# Altium schematic sheet Sheet1.SchDoc
size A4
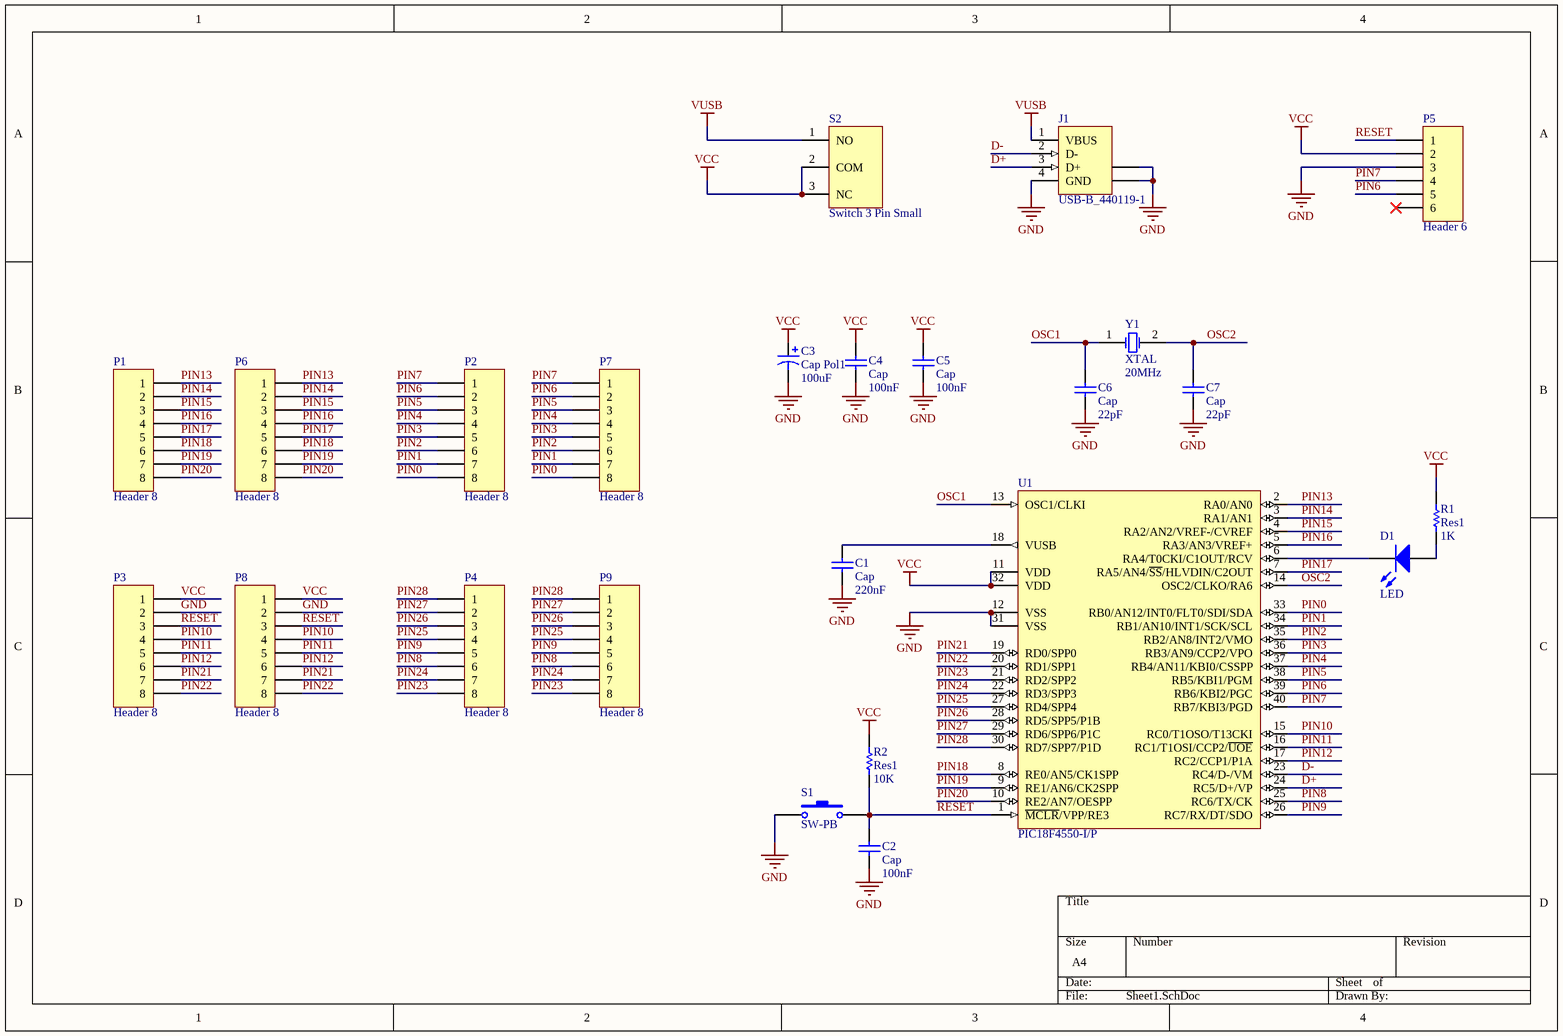
[diagram p0: Sheet1.SchDoc]

## Parts
C1  Cap  value 220nF  [C1206]
C2  Cap  value 100nF  [C1206]
C3  Cap Pol1  value 100uF  [CAP1]
C4  Cap  value 100nF  [C1206]
C5  Cap  value 100nF  [C1206]
C6  Cap  value 22pF  [C1206]
C7  Cap  value 22pF  [C1206]
D1  LED  [LED0]
J1  USB-B_440119-1  [USB-B]
P1  Header 8  [HDR1X8]
P2  Header 8  [HDR1X8]
P3  Header 8  [HDR1X8]
P4  Header 8  [HDR1X8]
P5  Header 6  [HDR1X6]
P6  Header 8  [HDR1X8]
P7  Header 8  [HDR1X8]
P8  Header 8  [HDR1X8]
P9  Header 8  [HDR1X8]
R1  Res1  value 1K  [C1206]
R2  Res1  value 10K  [C1206]
S1  SW-PB  [PUSH0]
S2  Switch 3 Pin Small  [SW_ON_OFF_SMALL]
U1  PIC18F4550-I/P  [PDIP600-P40]
Y1  XTAL  value 20MHz  [XTAL]

## Nets
GND: C1.1 C2.1 C3.2 C4.1 C5.1 C6.1 C7.1 J1.4(GND) J1.5(SHLD) J1.6(SHLD) P3.2 P5.3 P8.2 S1.1 U1.12(VSS) U1.31(VSS)
VCC: C3.1 C4.2 C5.2 P3.1 P5.2 P8.1 R1.2 R2.2 S2.2(COM) S2.3(NC) U1.11(VDD) U1.32(VDD)
VUSB: J1.1(VBUS) S2.1(NO)
D+: J1.3(D+) U1.24(RC5/D+/VP)
D-: J1.2(D-) U1.23(RC4/D-/VM)
OSC1: C6.2 U1.13(OSC1/CLKI) Y1.1(OSC1)
OSC2: C7.2 U1.14(OSC2/CLKO/RA6) Y1.2(OSC2)
PIN0: P2.8 P7.8 U1.33(RB0/AN12/INT0/FLT0/SDI/SDA)
PIN1: P2.7 P7.7 U1.34(RB1/AN10/INT1/SCK/SCL)
PIN2: P2.6 P7.6 U1.35(RB2/AN8/INT2/VMO)
PIN3: P2.5 P7.5 U1.36(RB3/AN9/CCP2/VPO)
PIN4: P2.4 P7.4 U1.37(RB4/AN11/KBI0/CSSPP)
PIN5: P2.3 P7.3 U1.38(RB5/KBI1/PGM)
PIN6: P2.2 P5.5 P7.2 U1.39(RB6/KBI2/PGC)
PIN7: P2.1 P5.4 P7.1 U1.40(RB7/KBI3/PGD)
PIN8: P4.6 P9.6 U1.25(RC6/TX/CK)
PIN9: P4.5 P9.5 U1.26(RC7/RX/DT/SDO)
PIN10: P3.4 P8.4 U1.15(RC0/T1OSO/T13CKI)
PIN11: P3.5 P8.5 U1.16(RC1/T1OSI/CCP2/~{UOE})
PIN12: P3.6 P8.6 U1.17(RC2/CCP1/P1A)
PIN13: P1.1 P6.1 U1.2(RA0/AN0)
PIN14: P1.2 P6.2 U1.3(RA1/AN1)
PIN15: P1.3 P6.3 U1.4(RA2/AN2/VREF-/CVREF)
PIN16: P1.4 P6.4 U1.5(RA3/AN3/VREF+)
PIN17: P1.5 P6.5 U1.7(RA5/AN4/~{SS}/HLVDIN/C2OUT)
PIN18: P1.6 P6.6 U1.8(RE0/AN5/CK1SPP)
PIN19: P1.7 P6.7 U1.9(RE1/AN6/CK2SPP)
PIN20: P1.8 P6.8 U1.10(RE2/AN7/OESPP)
PIN21: P3.7 P8.7 U1.19(RD0/SPP0)
PIN22: P3.8 P8.8 U1.20(RD1/SPP1)
PIN23: P4.8 P9.8 U1.21(RD2/SPP2)
PIN24: P4.7 P9.7 U1.22(RD3/SPP3)
PIN25: P4.4 P9.4 U1.27(RD4/SPP4)
PIN26: P4.3 P9.3 U1.28(RD5/SPP5/P1B)
PIN27: P4.2 P9.2 U1.29(RD6/SPP6/P1C)
PIN28: P4.1 P9.1 U1.30(RD7/SPP7/P1D)
RESET: C2.2 P3.3 P5.1 P8.3 R2.1 S1.2 U1.1(~{MCLR}/VPP/RE3)
NetC1_2: C1.2 U1.18(VUSB)
NetD1_1: D1.1(A) R1.1
NetD1_2: D1.2(K) U1.6(RA4/T0CKI/C1OUT/RCV)

Not connected (* = marked no-connect by the designer): P5 6*

## Library data of the parts
C1 C2 C4-C7 = Cap: Capacitor; Published: 8-Jun-2000; LatestRevisionDate: 17-Jul-2002; LatestRevisionNote: Re-released for DXP Platform.; PackageReference: RAD-0.3; Publisher: Altium Limited; PackageDescription: Radial Cap, Thru-Hole; 2 Leads; 0.3 in Pin Spacing
C3 = Cap Pol1: Polarized Capacitor (Radial); Published: 8-Jun-2000; LatestRevisionDate: 17-Jul-2002; LatestRevisionNote: Re-released for DXP Platform.; PackageReference: RB7.6-15; Publisher: Altium Limited; PackageDescription: Polarized Capacitor (Radial); 2 Leads
D1 = LED: Typical RED GaAs LED; Designer: Meysam Parvizi; Email: meysam.parvizi.ir@gmail.com; Weblog: http://mp.tabin.ir
J1 = USB-B_440119-1: USB 1.1, Right Angle, Thru-Hole, B Type, Receptacle, 4 Position, Beige; ContactMaterial: Copper Alloy; ContactPlating: Gold Flash over Nickel; TerminationLength: 2.84mm [0.112in.]; PCB_Layout: Complies with manufacturer's recommendation.; DrillSize: Corresponds to nominal value.; PanelGround: Without; Published: 15-Jul-2004; DatasheetDocument: 12-Jan-2004; PackageDocument: 12-Jan-2004; PackageReference: 440119; Publisher: Altium Limited; HousingMaterial: Thermoplastic; ComponentLink1Description: Manufacturer Link; ComponentLink1URL: http://www.tycoelectronics.com/; ComponentLink2Description: Packaging Specification; ComponentLink2URL: http://ecommas.tycoelectronics.com/commerce/DocumentDelivery/DDEController?Action=showdoc&DocId=Customer+Drawing%7F440119%7FC%7Ftif%7FEnglish%7FC_440119_C.tif
P1-P4 P6-P9 = Header 8: Header, 8-Pin; LatestRevisionDate: 17-Jul-2002; LatestRevisionNote: Re-released for DXP Platform.; Publisher: Altium Limited
P5 = Header 6: Header, 6-Pin; LatestRevisionDate: 17-Jul-2002; LatestRevisionNote: Re-released for DXP Platform.; Publisher: Altium Limited
R1 R2 = Res1: Resistor; Published: 8-Jun-2000; LatestRevisionDate: 17-Jul-2002; LatestRevisionNote: Re-released for DXP Platform.; PackageReference: AXIAL-0.3; Publisher: Altium Limited; PackageDescription: Axial Device, Thru-Hole; 2 Leads; 0.3 in Pin Spacing
S1 = SW-PB: Switch; Published: 24-Mar-1999; LatestRevisionDate: 17-Jul-2002; LatestRevisionNote: Re-released for DXP Platform.; PackageReference: SPST-2; Publisher: Altium Limited
S2 = Switch 3 Pin Small: Switch 3 Pin; Designer: Meysam Parvizi; Email: meysam.parvizi.ir@gmail.com; Weblog: http://mp.tabin.ir
U1 = PIC18F4550-I/P: High Performance, Enhanced Flash, USB Microcontroller with nanoWatt Technology, 32K Flash, 40-Pin PDIP, Industrial Temperature Range; Published: 29-Jan-2009; LatestRevisionDate: 02-Dec-2009; LatestRevisionNote: Updated to datasheet revision E, Aug-2008; DatasheetVersion: revE, Aug-2008; PackageVersion: revBB, Aug-2009; PackageReference: PDIP600-P40; Publisher: Altium Limited; PackageDescription: 40-Lead Plastic Dual In-Line (P) - 600 mil Body [PDIP]; Supplier 1: Digi-Key; Supplier Part Number 1: PIC18F4550-I/P-ND; Supplier 2: Farnell; Supplier Part Number 2: 1660062; Supplier 3: Farnell; Supplier Part Number 3: 9321357; ComponentLink1Description: Datasheet; ComponentLink1URL: http://ww1.microchip.com/downloads/en/DeviceDoc/39632e.pdf; ComponentLink2Description: Packaging Specification; ComponentLink2URL: http://www.microchip.com/stellent/groups/techpub_sg/documents/packagingspec/en012702.pdf; ComponentLink3Description: Microchip.com Home; ComponentLink3URL: http://www.microchip.com/
Y1 = XTAL: Crystal Oscillator; Designer: Meysam Parvizi; Email: meysam.parvizi.ir@gmail.com; Weblog: http://mp.tabin.ir